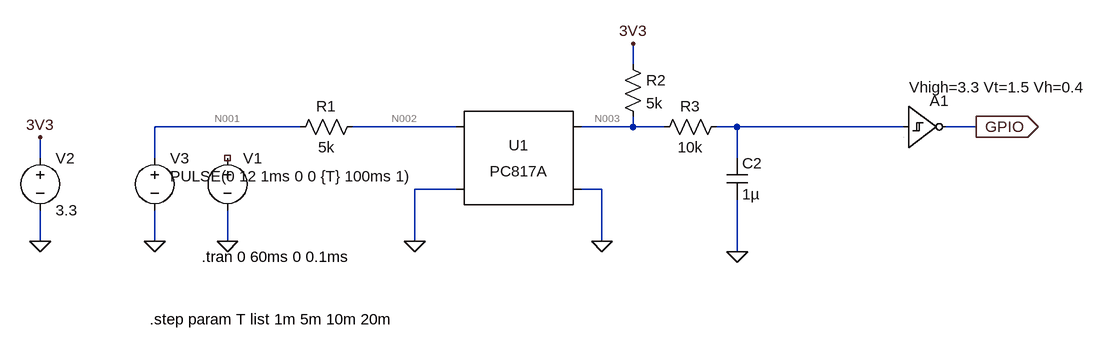
[diagram p0: schematic opto_input.asc]
opto_input.asc, the LTspice schematic file:
Version 4
SHEET 1 1428 680
WIRE 688 -32 688 -64
WIRE 176 64 -48 64
WIRE 416 64 256 64
WIRE 688 64 688 48
WIRE 688 64 608 64
WIRE 736 64 688 64
WIRE 848 64 816 64
WIRE 1104 64 848 64
WIRE 1216 64 1168 64
WIRE -224 112 -224 80
WIRE -48 112 -48 64
WIRE 848 112 848 64
WIRE 416 160 352 160
WIRE 640 160 608 160
WIRE -224 240 -224 192
WIRE -48 240 -48 192
WIRE 64 240 64 192
WIRE 352 240 352 160
WIRE 640 240 640 160
WIRE 848 256 848 176
FLAG 64 240 0
FLAG 352 240 0
FLAG 640 240 0
FLAG -224 240 0
FLAG 688 -64 3V3
FLAG -224 80 3V3
FLAG 1216 64 GPIO
IOPIN 1216 64 Out
FLAG 848 256 0
FLAG -48 240 0
SYMBOL voltage 64 96 R0
WINDOW 3 24 96 Invisible 2
WINDOW 123 0 0 Left 0
WINDOW 39 0 0 Left 0
SYMATTR Value SINE(6 6 10 0 0 100ms 100)
SYMATTR InstName V1
SYMBOL Optos\\PC817A 512 112 R0
SYMATTR InstName U1
SYMBOL res 272 48 R90
WINDOW 0 0 56 VBottom 2
WINDOW 3 32 56 VTop 2
SYMATTR InstName R1
SYMATTR Value 5k
SYMBOL voltage -224 96 R0
WINDOW 123 0 0 Left 0
WINDOW 39 0 0 Left 0
SYMATTR InstName V2
SYMATTR Value 3.3
SYMBOL res 672 -48 R0
SYMATTR InstName R2
SYMATTR Value 5k
SYMBOL cap 832 112 R0
SYMATTR InstName C2
SYMATTR Value 1µ
SYMBOL res 832 48 R90
WINDOW 0 0 56 VBottom 2
WINDOW 3 32 56 VTop 2
SYMATTR InstName R3
SYMATTR Value 10k
SYMBOL voltage -48 96 R0
WINDOW 3 24 44 Left 2
WINDOW 123 0 0 Left 0
WINDOW 39 0 0 Left 0
SYMATTR Value PULSE(0 12 1ms 0 0 {T} 100ms 1)
SYMATTR InstName V3
SYMBOL Digital\\schmtinv 1104 0 R0
WINDOW 3 9 3 Left 2
SYMATTR Value Vhigh=3.3 Vt=1.5 Vh=0.4
SYMATTR InstName A1
TEXT 24 264 Left 2 !.tran 0 60ms 0 0.1ms
TEXT -56 360 Left 2 !.step param T list 1m 5m 10m 20m

The netlist it stands for:
* opto_input.asc
V1 NC_01 0 SINE(6 6 10 0 0 100ms 100)
XU1 N002 0 N003 0 PC817 Igain=1m
R1 N002 N001 5k
V2 3V3 0 3.3
R2 3V3 N003 5k
C2 N004 0 1µ
R3 N004 N003 10k
V3 N001 0 PULSE(0 12 1ms 0 0 {T} 100ms 1)
A1 N004 0 0 0 0 GPIO 0 0 SCHMITT Vhigh=3.3 Vt=1.5 Vh=0.4
.tran 0 60ms 0 0.1ms
.step param T list 1m 5m 10m 20m
.lib PC817.sub
.backanno
.end

* Results of the author's LTspice run, read from the files saved beside the schematic
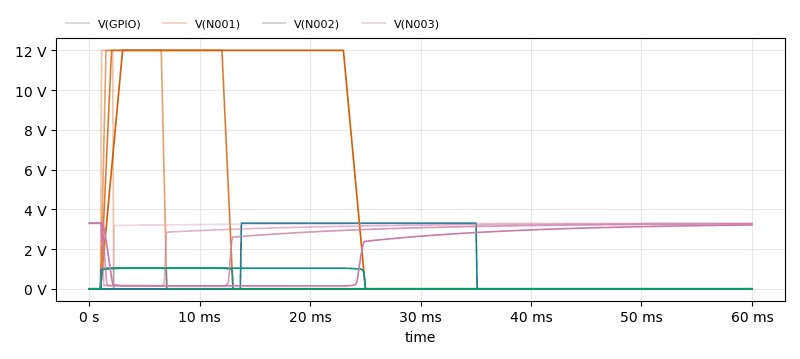
[diagram p1: Transient Analysis of opto_input.asc, plotted from the saved traces]
* Transient Analysis, 4 runs:
*   V(GPIO) [t=0.001]: min 0 V, max 0 V, average 0 V, rms 0 V, last 0 V
*   V(GPIO) [t=0.005]: min 0 V, max 0 V, average 0 V, rms 0 V, last 0 V
*   V(GPIO) [t=0.01]: min 0 V, max 0 V, average 0 V, rms 0 V, last 0 V
*   V(GPIO) [t=0.02]: min 0 V, max 3.3 V, average 1.174 V, rms 1.969 V, last 0 V
*   V(N001) [t=0.001]: min 0 V, max 12 V, average 220 mV, rms 1.6 V, last 0 V
*   V(N001) [t=0.005]: min 0 V, max 12 V, average 1.1 V, rms 3.578 V, last 0 V
*   V(N001) [t=0.01]: min 0 V, max 12 V, average 2.2 V, rms 5.06 V, last 0 V
*   V(N001) [t=0.02]: min 0 V, max 12 V, average 4.4 V, rms 7.156 V, last 0 V
*   V(N002) [t=0.001]: min 0 V, max 1.037 V, average 20.5 mV, rms 145.3 mV, last 0 V
*   V(N002) [t=0.005]: min 0 V, max 1.037 V, average 102.5 mV, rms 325 mV, last 0 V
*   V(N002) [t=0.01]: min 0 V, max 1.037 V, average 205 mV, rms 459.6 mV, last 0 V
*   V(N002) [t=0.02]: min 0 V, max 1.037 V, average 410 mV, rms 650 mV, last 0 V
*   V(N003) [t=0.001]: min 156.1 mV, max 3.3 V, average 3.213 V, rms 3.24 V, last 3.298 V
*   V(N003) [t=0.005]: min 151.1 mV, max 3.3 V, average 2.892 V, rms 3.025 V, last 3.287 V
*   V(N003) [t=0.01]: min 147.1 mV, max 3.3 V, average 2.532 V, rms 2.783 V, last 3.269 V
*   V(N003) [t=0.02]: min 143.1 mV, max 3.3 V, average 1.89 V, rms 2.33 V, last 3.212 V